# Altium schematic sheet UART.SchDoc
size A4
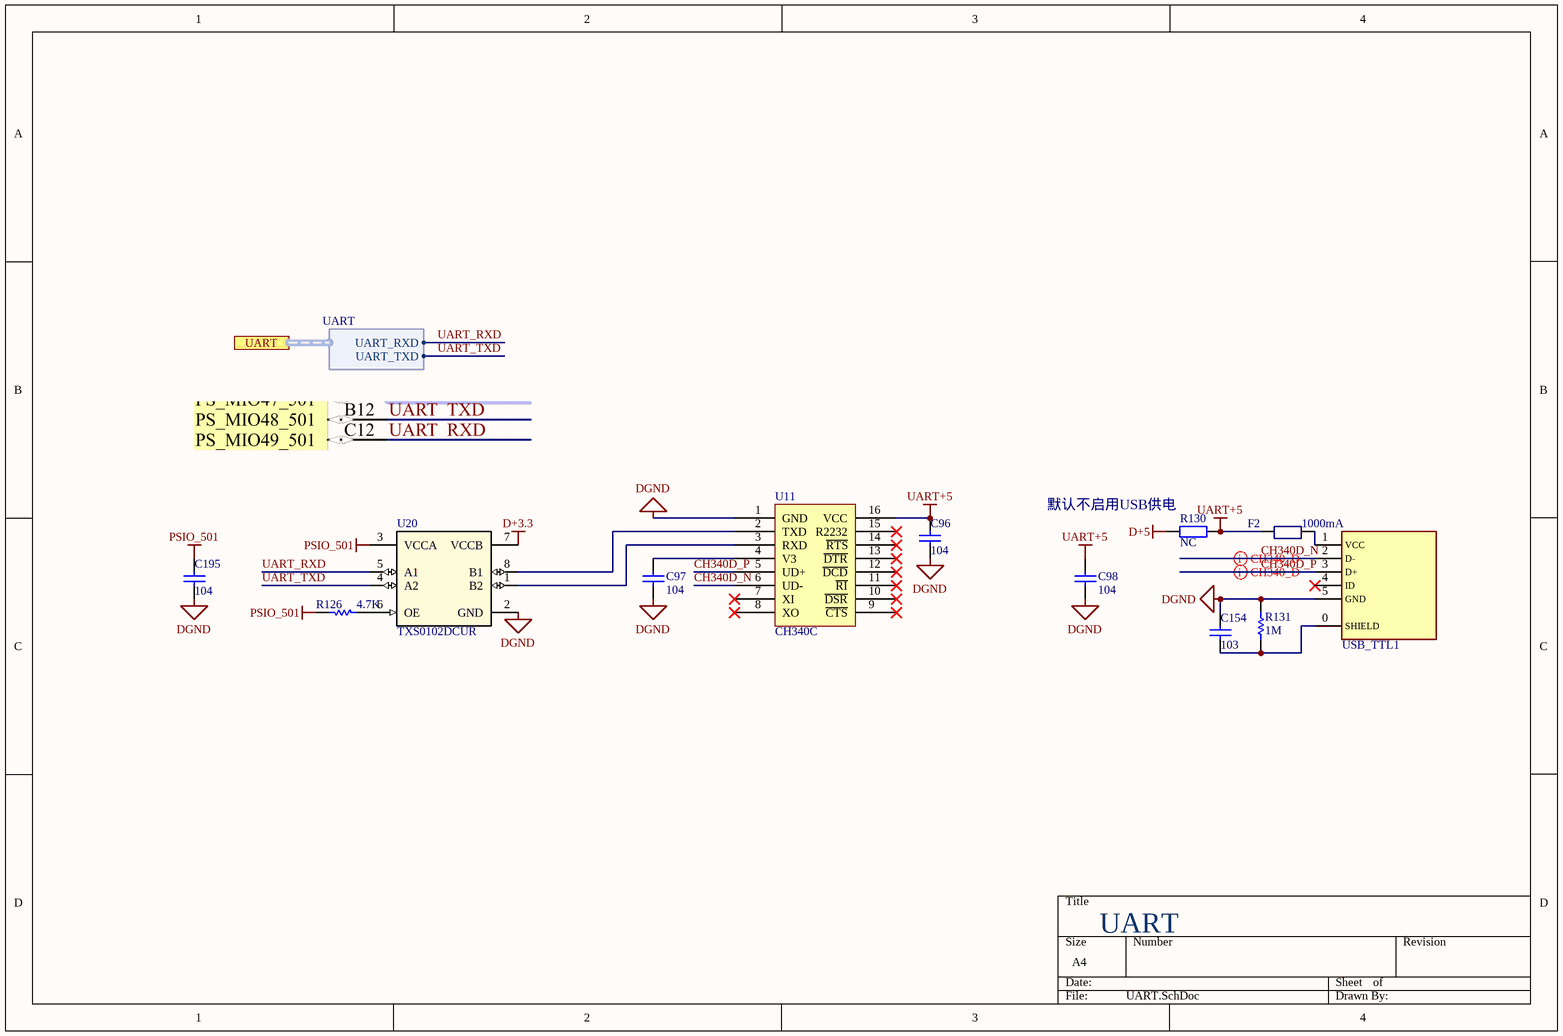
[diagram p0: UART.SchDoc]

## Parts
C96  104  [C 0402_LL]
C97  104  [C 0402_LL]
C98  104  [C 0402_LL]
C154  103  [C 0603_L]
C195  104  [C 0402_LL]
F2  1000mA  [FU 0805]
R126  4.7K  [R 0603_L]
R130  NC  [R 1206_L]
R131  1M  [R 0603_L]
U11  CH340C  [SOP16_L]
U20  TXS0102DCUR  [DCU0008A_N]
USB_TTL1  USB_miniB,microB  [USB-MINI-A]  (value not drawn)

## Ports
UART (harness UART)

## Harnesses
UART: UART_RXD, UART_TXD

## Nets
D+3.3: U20.7(VCCB)
D+5: R130.2
DGND: C96.1 C97.2 C98.1 C154.1 C195.1 R131.2 U11.1(GND) U20.2(GND) USB_TTL1.5(GND)
PSIO_501: C195.2 R126.2 U20.3(VCCA)
UART+5: C96.2 C98.2 F2.1 R130.1 U11.16(VCC)
CH340D_N: U11.6(UD-) USB_TTL1.2(D-)
CH340D_P: U11.5(UD+) USB_TTL1.3(D+)
UART_RXD: U20.5(A1) ; port UART.UART_RXD
UART_TXD: U20.4(A2) ; port UART.UART_TXD
NetC97_1: C97.1 U11.4(V3)
NetC154_2: C154.2 R131.1 USB_TTL1.0(SHIELD)
NetF2_2: F2.2 USB_TTL1.1(VCC)
NetR126_1: R126.1 U20.6(OE)
NetU11_2: U11.2(TXD) U20.8(B1)
NetU11_3: U11.3(RXD) U20.1(B2)

Not connected (* = marked no-connect by the designer): U11 7(XI)* 8(XO)* 9(~{CTS})* 10(~{DSR})* 11(~{RI})* 12(~{DCD})* 13(~{DTR})* 14(~{RTS})* 15(R2232)*; USB_TTL1 4(ID)*

## Layout directives
differential pair; differential pair class CH340D: CH340D_N, CH340D_P

## Notes on the sheet
- (near R130) 默认不启用USB供电
- UART

## Library data of the parts
C96-C98 C195 = Cap: Capacitor; Value: 100pF; Published: 8-Jun-2000; LatestRevisionDate: 17-Jul-2002; LatestRevisionNote: Re-released for DXP Platform.; PackageReference: RAD-0.3; Publisher: Altium Limited; PackageDescription: Radial Cap, Thru-Hole; 2 Leads; 0.3 in Pin Spacing
C154 = Cap: Capacitor; Published: 8-Jun-2000; LatestRevisionDate: 17-Jul-2002; LatestRevisionNote: Re-released for DXP Platform.; PackageReference: RAD-0.3; Publisher: Altium Limited; PackageDescription: Radial Cap, Thru-Hole; 2 Leads; 0.3 in Pin Spacing
F2 = PTC
R126 R131 = Res1: Resistor; Value: 1K; Published: 8-Jun-2000; LatestRevisionDate: 17-Jul-2002; LatestRevisionNote: Re-released for DXP Platform.; PackageReference: AXIAL-0.3; Publisher: Altium Limited; PackageDescription: Axial Device, Thru-Hole; 2 Leads; 0.3 in Pin Spacing
R130 = Res2: Resistor; Value: RES; Published: 8-Jun-2000; LatestRevisionDate: 17-Jul-2002; LatestRevisionNote: Re-released for DXP Platform.; PackageReference: AXIAL-0.4; Publisher: Altium Limited; PackageDescription: Axial Device, Thru-Hole; 2 Leads; 0.4 in Pin Spacing
U11 = CH340G
U20 = TXS0102DCUR: No Description Available; Mfr_Name: Texas Instruments; Type: DEV; RefDes: RefDes; Copyright: Copyright (C) 2022 Ultra Librarian. All rights reserved.; Manufacturer_Part_Number: TXS0102DCUR